# EAGLE design pdb_v4 (EAGLE 9.4.2)
Robot power distribution board v2.0. Provides stable 5V and 3.3V rails, a direct power output, and I2C expansion.
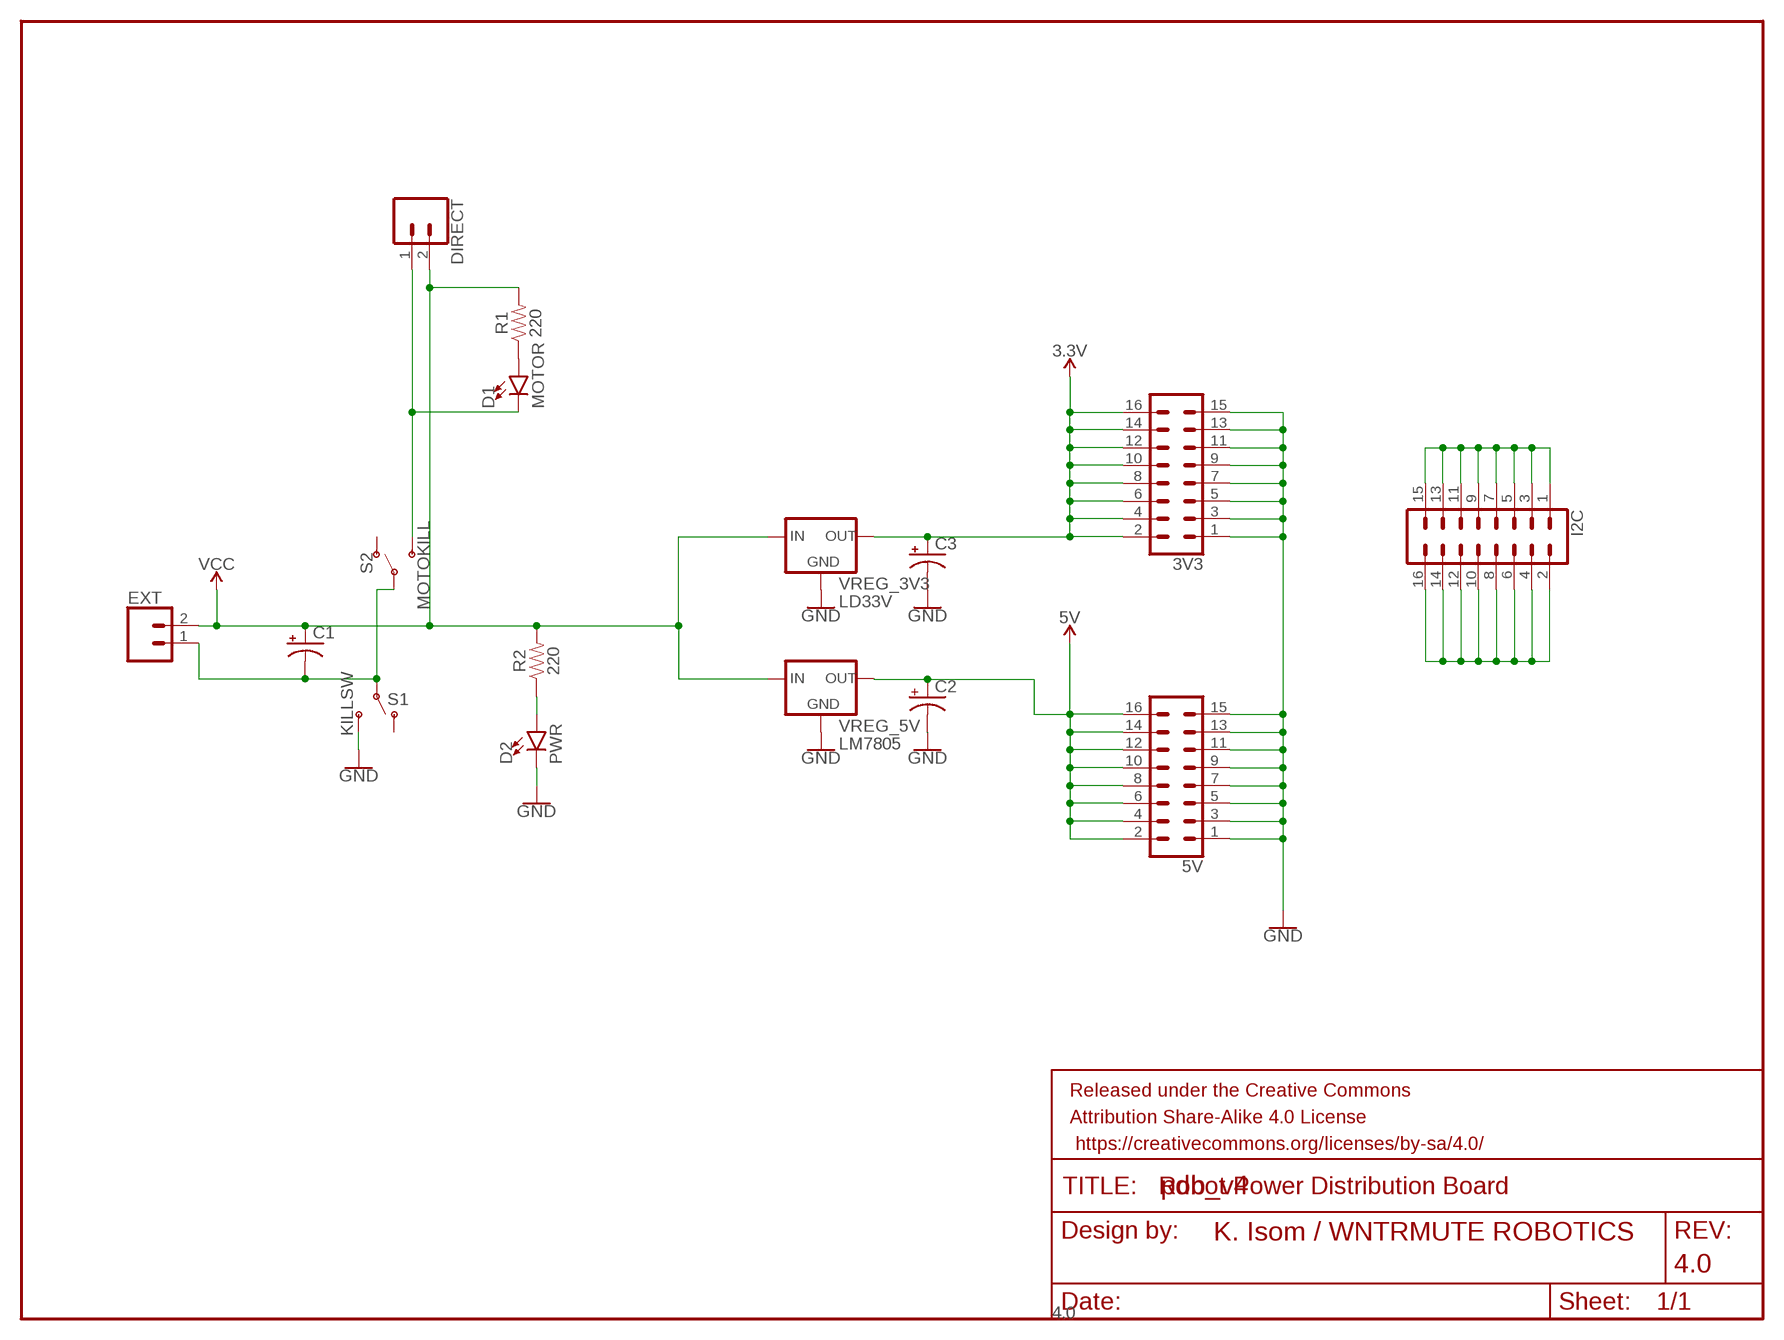
[diagram p0: schematic, sheet 1]

## Parts
3V3  CONN_08X2_HEADER  [2X8]
5V  CONN_08X2_HEADER  [2X8]
C1  1000uF  1000UF-RADIAL-5MM-25V-20%  [CPOL-RADIAL-5MM-10MM]
C2  100uF  CPOL-USE5-8.5  [E5-8,5]
C3  100uF  CPOL-USE5-8.5  [E5-8,5]
D1  MOTOR  LED3MM  [LED_3MM]
D2  PWR  LED3MM  [LED_3MM]
DIRECT  CONN_025MM  [SCREWTERMINAL-5MM-2]
EXT  CONN_025MM  [SCREWTERMINAL-5MM-2]
FRAME1  FRAME-LETTERNO_PACKAGE  [DUMMY]
I2C  CONN_08X2_HEADER  [2X8]
R1  220  220OHM-0603-1/10W-1%  [0603]
R2  220  220OHM-0603-1/10W-1%  [0603]
S1  KILLSW  SWITCH-SPDT-PTH-11.6X4.0MM-LOCK  [SWITCH_SPDT_PTH_11.6X4.0MM_LOCK]
S2  MOTOKILL  SWITCH-SPDT-PTH-11.6X4.0MM-LOCK  [SWITCH_SPDT_PTH_11.6X4.0MM_LOCK]
VREG_3V3  LD33V  V_REG_LD1117VXX  [78XXL]
VREG_5V  LM7805  V_REG_78XX-TO-220  [TO-220-ALT]

## Nets
3.3V: 3V3.2 3V3.4 3V3.6 3V3.8 3V3.10 3V3.12 3V3.14 3V3.16 C3.+ VREG_3V3.GND(OUT)
5V: 5V.2 5V.4 5V.6 5V.8 5V.10 5V.12 5V.14 5V.16 C2.+ VREG_5V.OUT
GND: 3V3.1 3V3.3 3V3.5 3V3.7 3V3.9 3V3.11 3V3.13 3V3.15 5V.1 5V.3 5V.5 5V.7 5V.9 5V.11 5V.13 5V.15 C2.- C3.- D2.K(C) S1.3(S) VREG_3V3.IN(GND) VREG_5V.GND
N$1: C1.- EXT.1 S1.2(P) S2.2(P)
N$2: D1.A R1.1
N$3: D2.A R2.1
N$7: I2C.1 I2C.3 I2C.5 I2C.7 I2C.9 I2C.11 I2C.13 I2C.15
N$9: I2C.2 I2C.4 I2C.6 I2C.8 I2C.10 I2C.12 I2C.14 I2C.16
N$11: D1.K(C) DIRECT.1 S2.3(S)
VCC: C1.+ DIRECT.2 EXT.2 R1.2 R2.2 VREG_3V3.OUT(IN) VREG_5V.IN
Unconnected: S1.1(O) S2.1(O)

## Notes on the sheet
- Robot Power Distribution Board

## Library data of the parts
3V3 5V I2C = SparkFun-Connectors:CONN_08X2: Multi connection point. Often used as Generic Header-pin footprint for 0.1 inch spaced/style header connections You can populate with any combo of single row headers, but if you'd like an exact match, check this: Header - 2x8 (Male, 0.1") <https://www.sparkfun.com/products/13156> (PRT-13156) On any of the 0.1 inch spaced packages, you can populate with these: Break Away Headers - Straight <https://www.sparkfun.com/products/116> (PRT-00116) Break Away Male Headers - Right Angle <https://www.sparkfun.com/products/553> (PRT-00553) Female Headers <https://www.sparkfun.com/products/115> (PRT-00115) Break Away Headers - Machine Pin <https://www.sparkfun.com/products/117> (PRT-00117) Break Away Female Headers - Swiss Machine Pin <https://www.sparkfun.com/products/743> (PRT-00743)
C1 = SparkFun-Capacitors:1000UF: 1,000µF/1mF ceramic capacitors A capacitor is a passive two-terminal electrical component used to store electrical energy temporarily in an electric field. CAP-08070; PROD_ID: CAP-09538; VALUE: 1mF
C2 C3 = rcl:CPOL-US: POLARIZED CAPACITOR, American symbol; SPICEPREFIX: C
D1 D2 = SparkFun-LED:LED: LED (Generic) Standard schematic elements and footprints for 5mm, 3mm, 1206, and 0603 sized LEDs. Generic LEDs with no color specified.; PROD_ID: DIO-08794
DIRECT EXT = SparkFun-Connectors:CONN_02: Multi connection point. Often used as Generic Header-pin footprint for 0.1 inch spaced/style header connections On any of the 0.1 inch spaced packages, you can populate with these: Break Away Headers - Straight <https://www.sparkfun.com/products/116> (PRT-00116) Break Away Male Headers - Right Angle <https://www.sparkfun.com/products/553> (PRT-00553) Female Headers <https://www.sparkfun.com/products/115> (PRT-00115) Break Away Headers - Machine Pin <https://www.sparkfun.com/products/117> (PRT-00117) Break Away Female Headers - Swiss Machine Pin <https://www.sparkfun.com/products/743> (PRT-00743) For SCREWTERMINALS and SPRING TERMINALS visit here: Screw Terimnals on SparkFun.com <https://www.sparkfun.com/search/results?term=Screw+Terminals> (5mm/3.5mm/2.54mm spacing) This device is also useful as a general connection point to wire up your design to another part of your project. Our various solder wires solder well into these plated through hole pads. Hook-Up Wire - Assortment (Stranded, 22 AWG) <https://www.sparkfun.com/products/11375> (PRT-11375) Hook-Up Wire - Assortment (Solid Core, 22 AWG) <https://www.sparkfun.com/products/11367> (PRT-11367) View the entire wire category on our website here <https://www.sparkfun.com/categories/141> Special notes: Molex polarized connector foot print use with: PRT-08233 with associated crimp pins and housings. 2.54_SCREWTERM for use with PRT-10571. 3.5mm Screw Terminal footprints for PRT-08084 5mm Screw Terminal footprints for use with PRT-08432; SF_SKU: PRT-08432
FRAME1 = SparkFun-Aesthetics:FRAME-LETTER: Schematic Frame - Letter Standard 8.5x11 US Letter frame; DESIGNER: K. Isom / WNTRMUTE ROBOTICS; REV: 4.0; VERSION: 4.0
R1 R2 = SparkFun-Resistors:220OHM: 220Ω resistor A resistor is a passive two-terminal electrical component that implements electrical resistance as a circuit element. Resistors act to reduce current flow, and, at the same time, act to lower voltage levels within circuits. - Wikipedia; PROD_ID: RES-07861
S1 S2 = SparkFun-Switches:SWITCH-SPDT: Single Pole, Double Throw (SPDT) Switch Single-pole, double-throw (SPDT) switch. Variant Overview SMD-AYZ0202 Surface Mount DPDT Switch <https://www.sparkfun.com/products/597> (COM-00597) Used on e.g. LilyPad Arduino USB - ATmega32U4 Board <https://www.sparkfun.com/products/12049> PTH-11.6X4.0MM SPDT Mini Power Switch <https://www.sparkfun.com/products/102> (COM-00102) Used on e.g. SparkFun Simon Says - Through-Hole Soldering Kit <https://www.sparkfun.com/products/10547> (KIT-10547) PTH-11.6X4.0MM-KIT KIT version of SPDT Mini Power Switch - Simplifies soldering by removing tStop of switch pins - only one side can be soldered. PTH-11.6X4.0MM-LOCK LOCK version of SPDT Mini Power Switch - Offset pins hold switch in place for easier soldering. SMD-RIGHT-ANGLE Surface Mount Right Angle Switch <https://www.sparkfun.com/products/10860> (COM-10860) Used on e.g. SparkFun ESP8266 Thing <https://www.sparkfun.com/products/13231>; PROD_ID: SWCH-08261; SF_SKU: COM-00102
VREG_3V3 = SparkFun-IC-Power:V_REG_LD1117VXX: LD1117VXX voltage regulator. We carry the 3.3V version (COM-00526) in TO-220 package.
VREG_5V = SparkFun-IC-Power:V_REG_78XX: Voltage Regulator Standard 78xx regulator. IGO (Input Ground Output). Spark Fun Electronics SKU : COM-00107; PROD_ID: VREG-08450; SF_ID: COM-00107

## Net classes
0 default: width 0.254 mm

## Board
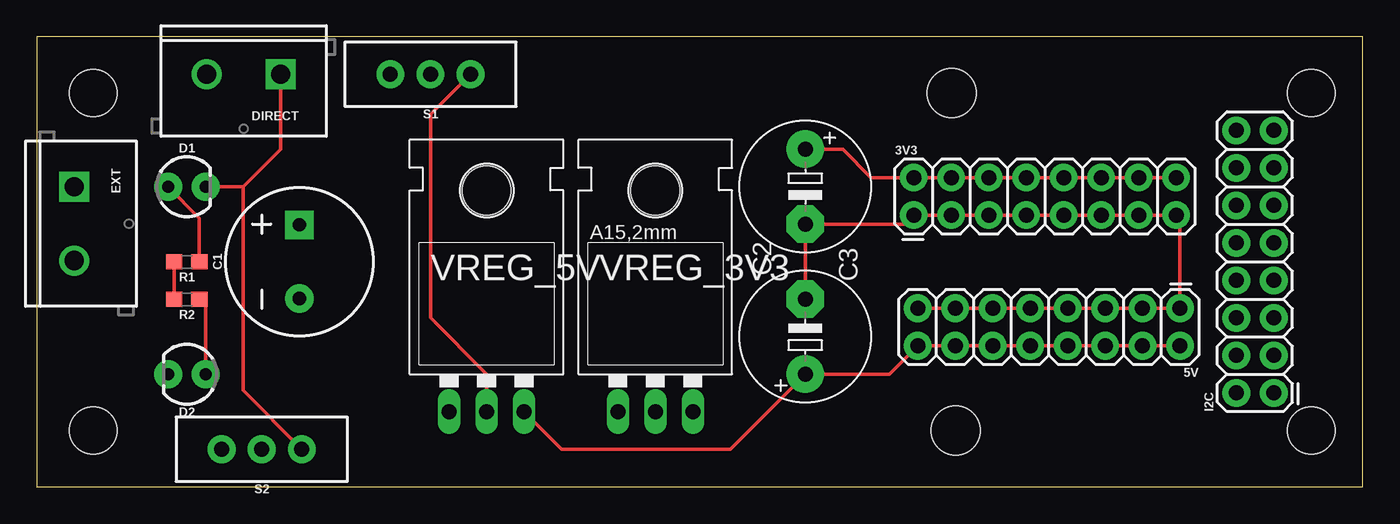
[diagram p1: board, top side]
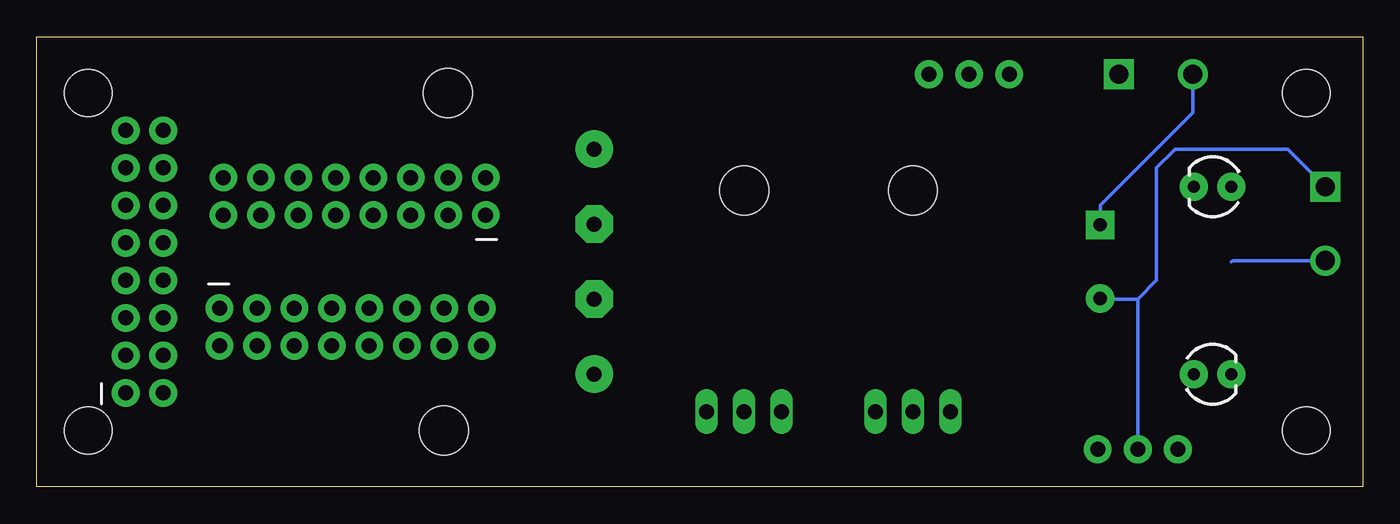
[diagram p2: board, bottom side, seen from below]

Size 89.84 x 30.47 mm. Coordinates in mm from the lower left corner, seen from the top.
Outline: 0,0 89.84,0 89.84,30.47 0,30.47 0,0
Copper layers (1*16): Top 0.035mm / dielectric 1.5mm / Bottom 0.035mm
Design rules "default": minimum track width 6mil, minimum drill 0.35mm, track to track 6mil, track to pad 6mil, pad to pad 6mil, via to via 6mil, smd to smd 6mil, copper to edge 40mil, drill to drill 6mil, minimum pad ring 10mil, minimum via ring 8mil, stop-mask expansion 4mil, vias tented up to drill 0mil, thermal gap 10mil
Holes 3.2 mm at 3.81,26.67 3.81,3.81 86.36,26.67 86.36,3.81
Holes 3.3 mm at 61.99,26.67 62.26,3.81

### Footprints (pad centres in the part's own frame; a part is rotated, then mirrored left to right if it is on the bottom)
2X8 = drill 1.016 pad 1.88: 1 0,0; 2 0,2.54; 3 2.54,0; 4 2.54,2.54; 5 5.08,0; 6 5.08,2.54; 7 7.62,0; 8 7.62,2.54; 9 10.16,0; 10 10.16,2.54; 11 12.7,0; 12 12.7,2.54; 13 15.24,0; 14 15.24,2.54; 15 17.78,0; 16 17.78,2.54
CPOL-RADIAL-5MM-10MM = drill 0.9 pad 1.93 square: + 2.5,0 | drill 0.9 pad 1.93: - -2.5,0
E5-8,5 = drill 1.016 pad 2.54: + -2.54,0 | drill 1.016 pad 2.54 octagon: - 2.54,0
LED_3MM = drill 0.813 pad 1.88: A -1.27,0; K 1.27,0
SCREWTERMINAL-5MM-2 = drill 1.3 pad 2.032 square: 1 0,0 | drill 1.3 pad 2.032: 2 5,0
0603 = smd 1.1 x 1: 1 -0.85,0; 2 0.85,0
SWITCH_SPDT_PTH_11.6X4.0MM_LOCK = drill 1.016 pad 1.88: 1 0,2.718; 2 0,0; 3 0,-2.718
78XXL = drill 1.016 long: GND 0,-3.81; IN -2.54,-3.81; OUT 2.54,-3.81 | hole 3.302: 0,11.176
TO-220-ALT = drill 1.016 long: GND 0,-3.81; IN -2.54,-3.81; OUT 2.54,-3.81 | hole 3.302: 0,11.176

### Placement (x,y rotation side)
3V3  59.42,18.4 0 top
5V  77.47,12.08 180 top
C1  17.78,15.24 90 top
C2  52.07,10.16 90 top
C3  52.07,20.32 270 top
D1  10.16,20.32 0 top
D2  10.16,7.62 180 top
DIRECT  16.51,27.94 180 top
EXT  2.54,20.32 270 top
FRAME1  -55.88,50.8 0 top  (outside the outline)
I2C  83.82,6.35 90 top
R1  10.16,15.24 180 top
R2  10.16,12.7 180 top
S1  26.67,27.94 90 top
S2  15.24,2.54 90 top
VREG_3V3  41.91,8.89 0 top
VREG_5V  30.48,8.89 0 top

### Tracks (layer width: path | path; a pad name or v marks a point on that pad's centre or on a via)
3.3V
  Top 0.254: 3V3.16 3V3.14 3V3.12 3V3.10 3V3.8 3V3.6 3V3.4 3V3.2 56.53,20.94 54.61,22.86 C3.+
5V
  Top 0.254: 5V.2 5V.4 5V.6 5V.8 5V.10 5V.12 5V.14 5V.16 57.77,7.62 C2.+ 46.99,2.54 35.56,2.54 VREG_5V.OUT
GND
  Top 0.254: 5V.15 5V.13 5V.11 5V.9 5V.7 5V.5 5V.3 5V.1 77.47,18.13 3V3.15 3V3.13 3V3.11 3V3.9 3V3.7 3V3.5 3V3.3 3V3.1 58.8,17.78 C3.- C2.- | S1.3 26.67,25.22 26.67,11.43 30.48,7.62 VREG_5V.GND
N$1
  Bottom 0.254: EXT.1 5.08,22.86 12.7,22.86 13.97,21.59 13.97,13.97 15.24,12.7 | 15.24,12.7 17.74,12.7 C1.- | 15.24,12.7 S2.2
N$2
  Top 0.254: R1.1 11.01,18.2 D1.A
N$3
  Top 0.254: R2.1 11.43,12.28 D2.A
N$11
  Top 0.254: D1.K 13.97,20.32 | 13.97,20.32 16.51,22.86 DIRECT.1 | S2.3 13.97,6.53 13.97,20.32
VCC
  Top 0.254: R1.2 R2.2
  Bottom 0.254: EXT.2 8.81,15.32 8.89,15.24 | DIRECT.2 11.51,25.32 17.78,19.05 C1.+